# Altium project SW_SWITCHED_LPF_BANK.PrjPcb
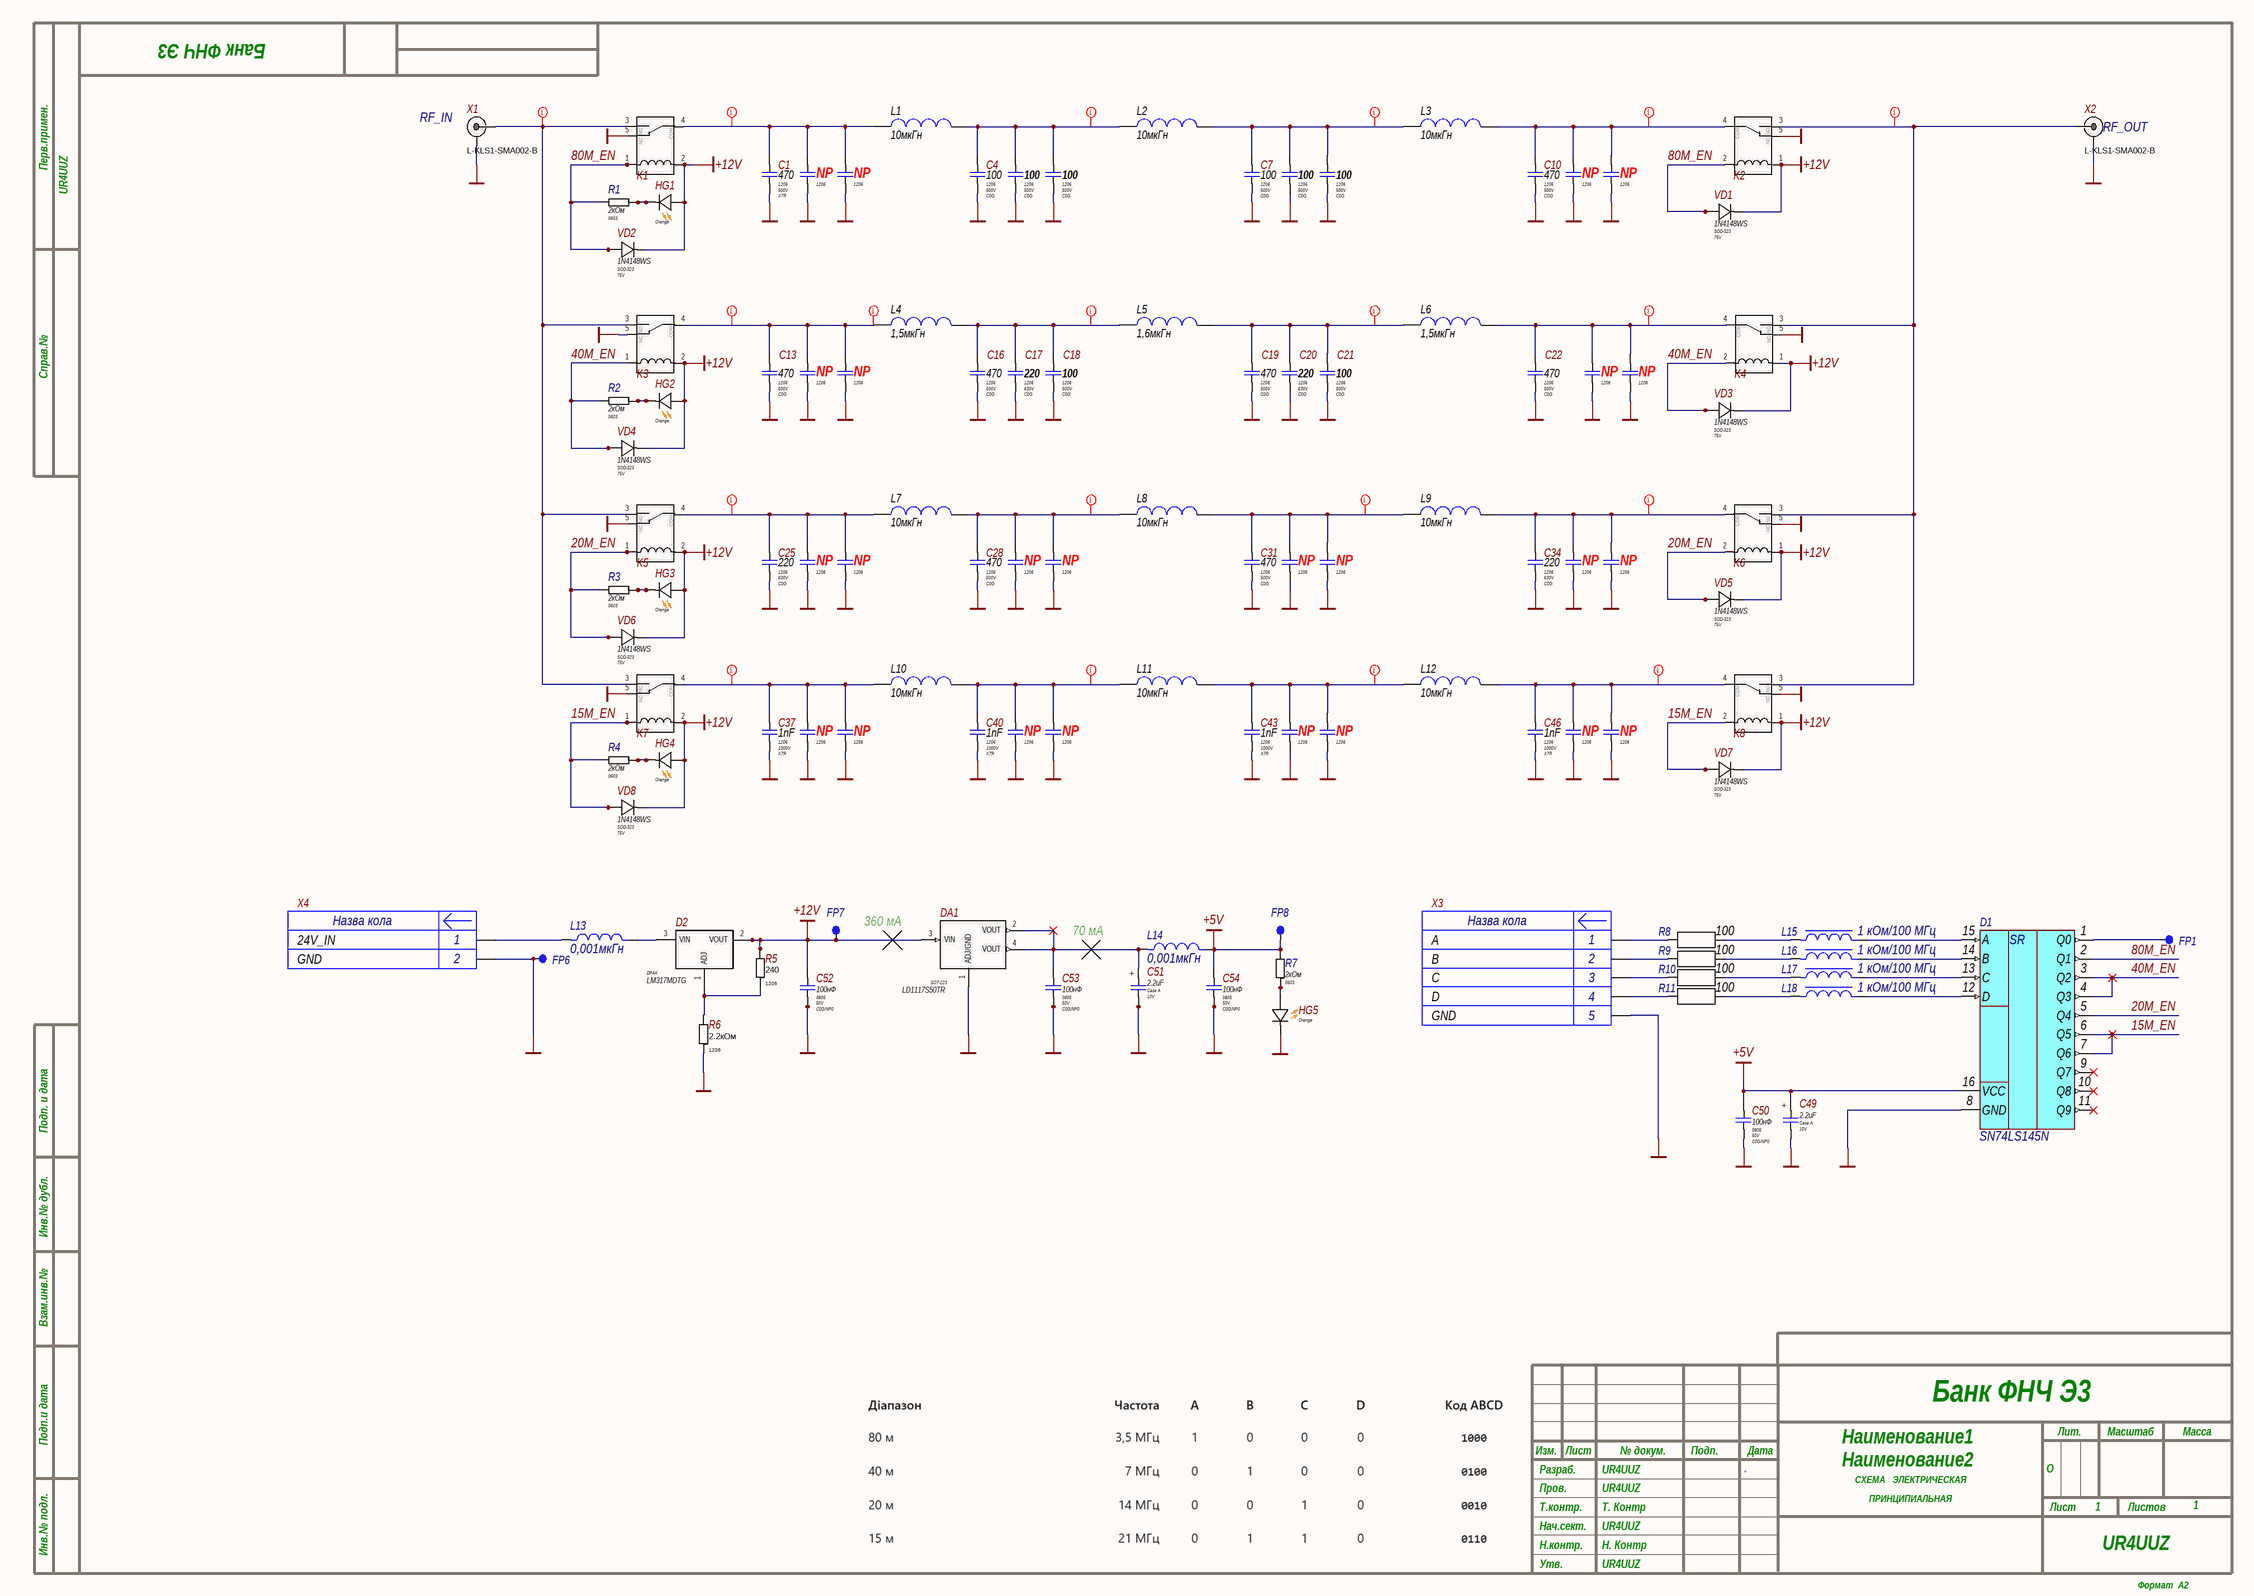
[diagram p0: SW_SWITCHED_LPF_BANK.SchDoc]
__Project_Template_Version: 1.0.2; _Amount_Boards_Per_Stand: 1; _PCB_Order_Accuracy: 0.2mm / 8mil; _PCB_Order_BoardOutlineLayer: Mechanical1 (GM1); _PCB_Order_Cooper: 1oz / 35um; _PCB_Order_ElectricTest: Necessarily for 100% samples; _PCB_Order_Finish: HASL; _PCB_Order_LayersCnt: 2; _PCB_Order_Mask: on both sides; _PCB_Order_MaskColor: Green / Yellow; _PCB_Order_Material: FR-4; _PCB_Order_MinHole: 0.3 mm; _PCB_Order_ProductionTime: 2 weeks; _PCB_Order_Silk: No; _PCB_Order_SilkColor: No; _PCB_Order_Size: 0 x 0 mm; _PCB_Order_Thickness: 1.6 mm; Product_Name: DEV.Tnn.BRD; Project_ID: 621; Project_Version: 1
1 sheet, 115 parts. Net scope: global (net labels, ports and power ports of the same name join across sheets).
Board file: SW_SWITCHED_LPF_BANK.PcbDoc

## Sheet SW_SWITCHED_LPF_BANK.SchDoc: Наименование
size 594 x 420 mm; Product name: DEV.Tnn.BRD; Internal reference: 621; Head: DEV.Tnn.BRD.621.v1; PCB_Designator: DEV.Tnn.BRD.621.v1; Template_version: 1.0.1; ApprovedBy: UR4UUZ; CheckedBy: UR4UUZ; Author: UR4UUZ; CompanyName: UR4UUZ; SheetNumber: 1; SheetTotal: 1; PageSetup: Record=PageOptions|CenterHorizontal=True|CenterVertical=True|PrintScale=0.94|XCorrection=1.00|YCorrection=1.00|PrintKind=1|BorderSize=5000000|LeftOffset=0|BottomOffset=0|Orientation=1|PaperLength=1000|PaperWidth=1000|Scale=100|PaperSource=7|PrintQuality=-4|MediaType=1|DitherType=10|PaperKind=A4|PrintScaleMode=1; DecimalNumber: Банк ФНЧ; HeadOfSector: UR4UUZ; MainDevice: UR4UUZ; Name1: Наименование1; lit_A: О; n_kontr: Н. Контр; t_kontr: Т. Контр; Name2: Наименование2; DocumentName: Sheet1.SCHDOC

### Parts
C1  value 470  Package: 1206  Voltage: 500V  Dielectric Type: X7R  [C_CERAMIC_1206_MED]  (hidden comment: 1nF)
C2  value NP  Package: 1206  [C_CERAMIC_1206_MED]  (hidden comment: 1nF)
C3  value NP  Package: 1206  [C_CERAMIC_1206_MED]  (hidden comment: 1nF)
C4  value 100  Package: 1206  Voltage: 500V  Dielectric Type: C0G  [C_CERAMIC_1206_MED]  (hidden comment: 1nF)
C5  value 100  Package: 1206  Voltage: 500V  Dielectric Type: C0G  [C_CERAMIC_1206_MED]  (hidden comment: 1nF)
C6  value 100  Package: 1206  Voltage: 500V  Dielectric Type: C0G  [C_CERAMIC_1206_MED]  (hidden comment: 1nF)
C7  value 100  Package: 1206  Voltage: 500V  Dielectric Type: C0G  [C_CERAMIC_1206_MED]  (hidden comment: 1nF)
C8  value 100  Package: 1206  Voltage: 500V  Dielectric Type: C0G  [C_CERAMIC_1206_MED]  (hidden comment: 1nF)
C9  value 100  Package: 1206  Voltage: 500V  Dielectric Type: C0G  [C_CERAMIC_1206_MED]  (hidden comment: 1nF)
C10  value 470  Package: 1206  Voltage: 500V  Dielectric Type: COG  [C_CERAMIC_1206_MED]  (hidden comment: 1nF)
C11  value NP  Package: 1206  [C_CERAMIC_1206_MED]  (hidden comment: 1nF)
C12  value NP  Package: 1206  [C_CERAMIC_1206_MED]  (hidden comment: 1nF)
C13  value 470  Package: 1206  Voltage: 500V  Dielectric Type: C0G  [C_CERAMIC_1206_MED]  (hidden comment: 1nF)
C14  value NP  Package: 1206  [C_CERAMIC_1206_MED]  (hidden comment: 1nF)
C15  value NP  Package: 1206  [C_CERAMIC_1206_MED]  (hidden comment: 1nF)
C16  value 470  Package: 1206  Voltage: 500V  Dielectric Type: C0G  [C_CERAMIC_1206_MED]  (hidden comment: 1nF)
C17  value 220  Package: 1206  Voltage: 630V  Dielectric Type: C0G  [C_CERAMIC_1206_MED]  (hidden comment: 1nF)
C18  value 100  Package: 1206  Voltage: 500V  Dielectric Type: C0G  [C_CERAMIC_1206_MED]  (hidden comment: 1nF)
C19  value 470  Package: 1206  Voltage: 500V  Dielectric Type: C0G  [C_CERAMIC_1206_MED]  (hidden comment: 1nF)
C20  value 220  Package: 1206  Voltage: 630V  Dielectric Type: C0G  [C_CERAMIC_1206_MED]  (hidden comment: 1nF)
C21  value 100  Package: 1206  Voltage: 500V  Dielectric Type: C0G  [C_CERAMIC_1206_MED]  (hidden comment: 1nF)
C22  value 470  Package: 1206  Voltage: 500V  Dielectric Type: C0G  [C_CERAMIC_1206_MED]  (hidden comment: 1nF)
C23  value NP  Package: 1206  [C_CERAMIC_1206_MED]  (hidden comment: 1nF)
C24  value NP  Package: 1206  [C_CERAMIC_1206_MED]  (hidden comment: 1nF)
C25  value 220  Package: 1206  Voltage: 630V  Dielectric Type: C0G  [C_CERAMIC_1206_MED]  (hidden comment: 1nF)
C26  value NP  Package: 1206  [C_CERAMIC_1206_MED]  (hidden comment: 1nF)
C27  value NP  Package: 1206  [C_CERAMIC_1206_MED]  (hidden comment: 1nF)
C28  value 470  Package: 1206  Voltage: 500V  Dielectric Type: C0G  [C_CERAMIC_1206_MED]  (hidden comment: 1nF)
C29  value NP  Package: 1206  [C_CERAMIC_1206_MED]  (hidden comment: 1nF)
C30  value NP  Package: 1206  [C_CERAMIC_1206_MED]  (hidden comment: 1nF)
C31  value 470  Package: 1206  Voltage: 500V  Dielectric Type: C0G  [C_CERAMIC_1206_MED]  (hidden comment: 1nF)
C32  value NP  Package: 1206  [C_CERAMIC_1206_MED]  (hidden comment: 1nF)
C33  value NP  Package: 1206  [C_CERAMIC_1206_MED]  (hidden comment: 1nF)
C34  value 220  Package: 1206  Voltage: 630V  Dielectric Type: C0G  [C_CERAMIC_1206_MED]  (hidden comment: 1nF)
C35  value NP  Package: 1206  [C_CERAMIC_1206_MED]  (hidden comment: 1nF)
C36  value NP  Package: 1206  [C_CERAMIC_1206_MED]  (hidden comment: 1nF)
C37  Package: 1206  Voltage: 1000V  Dielectric Type: X7R  [C_CERAMIC_1206_MED]  (hidden comment: 1nF)
C38  value NP  Package: 1206  [C_CERAMIC_1206_MED]  (hidden comment: 1nF)
C39  value NP  Package: 1206  [C_CERAMIC_1206_MED]  (hidden comment: 1nF)
C40  Package: 1206  Voltage: 1000V  Dielectric Type: X7R  [C_CERAMIC_1206_MED]  (hidden comment: 1nF)
C41  value NP  Package: 1206  [C_CERAMIC_1206_MED]  (hidden comment: 1nF)
C42  value NP  Package: 1206  [C_CERAMIC_1206_MED]  (hidden comment: 1nF)
C43  Package: 1206  Voltage: 1000V  Dielectric Type: X7R  [C_CERAMIC_1206_MED]  (hidden comment: 1nF)
C44  value NP  Package: 1206  [C_CERAMIC_1206_MED]  (hidden comment: 1nF)
C45  value NP  Package: 1206  [C_CERAMIC_1206_MED]  (hidden comment: 1nF)
C46  Package: 1206  Voltage: 1000V  Dielectric Type: X7R  [C_CERAMIC_1206_MED]  (hidden comment: 1nF)
C47  value NP  Package: 1206  [C_CERAMIC_1206_MED]  (hidden comment: 1nF)
C48  value NP  Package: 1206  [C_CERAMIC_1206_MED]  (hidden comment: 1nF)
C49  Package: Case A  Voltage: 10V  [C_TANTAL_CASE_A_MED]  (hidden comment: 2.2uF)
C50  value 100нФ  Package: 0805  Voltage: 50V  Dielectric Type: C0G/NP0  [CAP-0805(2012)X85T10]  (hidden comment: 68pF)
C51  Package: Case A  Voltage: 10V  [C_TANTAL_CASE_A_MED]  (hidden comment: 2.2uF)
C52  value 100нФ  Package: 0805  Voltage: 50V  Dielectric Type: C0G/NP0  [CAP-0805(2012)X85T10]  (hidden comment: 68pF)
C53  value 100нФ  Package: 0805  Voltage: 50V  Dielectric Type: C0G/NP0  [CAP-0805(2012)X85T10]  (hidden comment: 68pF)
C54  value 100нФ  Package: 0805  Voltage: 50V  Dielectric Type: C0G/NP0  [CAP-0805(2012)X85T10]  (hidden comment: 68pF)
D1  SN74LS145N  [DIP-16]
D2  LM317MDTG  [DPAK]
DA1  LD1117S50TR  [SOT-223]
FP1  *  [Pad_Disc_1.6x2.0mm_D1.0mm]  (value not drawn)  (no BOM)
FP6  *  [Pad_Disc_1.6x2.0mm_D1.0mm]  (value not drawn)  (no BOM)
FP7  *  [Pad_Disc_1.6x2.0mm_D1.0mm]  (value not drawn)  (no BOM)
FP8  *  [Pad_Disc_1.6x2.0mm_D1.0mm]  (value not drawn)  (no BOM)
HG1  Color: Orange  [LTST-C193KFKT-5A]  (hidden comment: LTST-C193KFKT-5A)
HG2  Color: Orange  [LTST-C193KFKT-5A]  (hidden comment: LTST-C193KFKT-5A)
HG3  Color: Orange  [LTST-C193KFKT-5A]  (hidden comment: LTST-C193KFKT-5A)
HG4  Color: Orange  [LTST-C193KFKT-5A]  (hidden comment: LTST-C193KFKT-5A)
HG5  Color: Orange  [LTST-C193KFKT-5A]  (hidden comment: LTST-C193KFKT-5A)
K1  LEG-12  [LEG-xx]  (value not drawn)
K2  LEG-12  [LEG-xx]  (value not drawn)
K3  LEG-12  [LEG-xx]  (value not drawn)
K4  LEG-12  [LEG-xx]  (value not drawn)
K5  LEG-12  [LEG-xx]  (value not drawn)
K6  LEG-12  [LEG-xx]  (value not drawn)
K7  LEG-12  [LEG-xx]  (value not drawn)
K8  LEG-12  [LEG-xx]  (value not drawn)
L1  value 10мкГн  [IND: R26.9/14.7/11.2 (H)]
L2  value 10мкГн  [IND: R26.9/14.7/11.2 (H)]
L3  value 10мкГн  [IND: R26.9/14.7/11.2 (H)]
L4  value 1,5мкГн  [IND: R26.9/14.7/11.2 (H)]
L5  value 1,6мкГн  [IND: R26.9/14.7/11.2 (H)]
L6  value 1,5мкГн  [IND: R26.9/14.7/11.2 (H)]
L7  value 10мкГн  [IND: R26.9/14.7/11.2 (H)]
L8  value 10мкГн  [IND: R26.9/14.7/11.2 (H)]
L9  value 10мкГн  [IND: R26.9/14.7/11.2 (H)]
L10  value 10мкГн  [IND: R26.9/14.7/11.2 (H)]
L11  value 10мкГн  [IND: R26.9/14.7/11.2 (H)]
L12  value 10мкГн  [IND: R26.9/14.7/11.2 (H)]
L13  0,001мкГн  [INDWW_1206_3.56x2.16x1.52mm_ATC_WL]
L14  0,001мкГн  [INDWW_1206_3.56x2.16x1.52mm_ATC_WL]
L15  1 кОм/100 МГц  [FB_0402_1.0x0.5x0.5mm]
L16  1 кОм/100 МГц  [FB_0402_1.0x0.5x0.5mm]
L17  1 кОм/100 МГц  [FB_0402_1.0x0.5x0.5mm]
L18  1 кОм/100 МГц  [FB_0402_1.0x0.5x0.5mm]
R1  value 2кОм  Package: 0603  [RES0603]  (hidden comment: 2k)
R2  value 2кОм  Package: 0603  [RES0603]  (hidden comment: 2k)
R3  value 2кОм  Package: 0603  [RES0603]  (hidden comment: 2k)
R4  value 2кОм  Package: 0603  [RES0603]  (hidden comment: 2k)
R5  value 240  Package: 1206  [R_ANY_CHIP_1206_MED]  (hidden comment: 499k)
R6  value 2.2кОм  Package: 1206  [R_ANY_CHIP_1206_MED]  (hidden comment: 499k)
R7  value 2кОм  Package: 0603  [RES0603]  (hidden comment: 2k)
R8  100  [R_ANY_CHIP_0402_HI]
R9  100  [R_ANY_CHIP_0402_HI]
R10  100  [R_ANY_CHIP_0402_HI]
R11  100  [R_ANY_CHIP_0402_HI]
VD1  Package: SOD-323  Voltage: 75V  [SOD-323_MED]  (hidden comment: 1N4148WS)
VD2  Package: SOD-323  Voltage: 75V  [SOD-323_MED]  (hidden comment: 1N4148WS)
VD3  Package: SOD-323  Voltage: 75V  [SOD-323_MED]  (hidden comment: 1N4148WS)
VD4  Package: SOD-323  Voltage: 75V  [SOD-323_MED]  (hidden comment: 1N4148WS)
VD5  Package: SOD-323  Voltage: 75V  [SOD-323_MED]  (hidden comment: 1N4148WS)
VD6  Package: SOD-323  Voltage: 75V  [SOD-323_MED]  (hidden comment: 1N4148WS)
VD7  Package: SOD-323  Voltage: 75V  [SOD-323_MED]  (hidden comment: 1N4148WS)
VD8  Package: SOD-323  Voltage: 75V  [SOD-323_MED]  (hidden comment: 1N4148WS)
X1  KLS1-SMA002-B  [KLS1-SMA002]  (value not drawn)
X2  KLS1-SMA002-B  [KLS1-SMA002]  (value not drawn)
X3  WH-05S  [WF-5S]  (value not drawn)
X4  WH-02S  [WF-2S]  (value not drawn)

### Nets
+5V: C49.1 C50.1 C54.1 D1.16(VCC) FP8.1 L14.2 R7.1
+12V: C52.1 D2.2(VOUT) DA1.3(VIN) FP7.1 HG1.AN(Anode) HG2.AN(Anode) HG3.AN(Anode) HG4.AN(Anode) K1.2 K2.1 K3.2 K4.1 K5.2 K6.1 K7.2 K8.1 R5.1 VD1.CA VD2.CA VD3.CA VD4.CA VD5.CA VD6.CA VD7.CA VD8.CA
GND: C1.2 C2.2 C3.2 C4.2 C5.2 C6.2 C7.2 C8.2 C9.2 C10.2 C11.2 C12.2 C13.2 C14.2 C15.2 C16.2 C17.2 C18.2 C19.2 C20.2 C21.2 C22.2 C23.2 C24.2 C25.2 C26.2 C27.2 C28.2 C29.2 C30.2 C31.2 C32.2 C33.2 C34.2 C35.2 C36.2 C37.2 C38.2 C39.2 C40.2 C41.2 C42.2 C43.2 C44.2 C45.2 C46.2 C47.2 C48.2 C49.2 C50.2 C51.2 C52.2 C53.2 C54.2 D1.8(GND) DA1.1(ADJ/GND) FP6.1 HG5.CA(Cathode) K1.5(NC) K2.5(NC) K3.5(NC) K4.5(NC) K5.5(NC) K6.5(NC) K7.5(NC) K8.5(NC) R6.2 X1.2 X2.2 X3.5 X4.2
15M_EN: D1.6(Q5) D1.7(Q6) K7.1 K8.2 R4.1 VD7.AN VD8.AN
20M_EN: D1.5(Q4) K5.1 K6.2 R3.1 VD5.AN VD6.AN
40M_EN: D1.3(Q2) D1.4(Q3) K3.1 K4.2 R2.1 VD3.AN VD4.AN
80M_EN: D1.2(Q1) K1.1 K2.2 R1.1 VD1.AN VD2.AN
NetC1_1: C1.1 C2.1 C3.1 K1.4(COM) L1.2
NetC4_1: C4.1 C5.1 C6.1 L1.1 L2.2
NetC7_1: C7.1 C8.1 C9.1 L2.1 L3.2
NetC10_1: C10.1 C11.1 C12.1 K2.4(COM) L3.1
NetC13_1: C13.1 C14.1 C15.1 K3.4(COM) L4.2
NetC16_1: C16.1 C17.1 C18.1 L4.1 L5.2
NetC19_1: C19.1 C20.1 C21.1 L5.1 L6.2
NetC22_1: C22.1 C23.1 C24.1 K4.4(COM) L6.1
NetC25_1: C25.1 C26.1 C27.1 K5.4(COM) L7.2
NetC28_1: C28.1 C29.1 C30.1 L7.1 L8.2
NetC31_1: C31.1 C32.1 C33.1 L8.1 L9.2
NetC34_1: C34.1 C35.1 C36.1 K6.4(COM) L9.1
NetC37_1: C37.1 C38.1 C39.1 K7.4(COM) L10.2
NetC40_1: C40.1 C41.1 C42.1 L10.1 L11.2
NetC43_1: C43.1 C44.1 C45.1 L11.1 L12.2
NetC46_1: C46.1 C47.1 C48.1 K8.4(COM) L12.1
NetC51_1: C51.1 C53.1 DA1.2(VOUT) DA1.4(VOUT) L14.1
NetD1_1: D1.1(Q0) FP1.1
NetD1_12: D1.12(D) L18.2
NetD1_13: D1.13(C) L17.2
NetD1_14: D1.14(B) L16.2
NetD1_15: D1.15(A) L15.2
NetD2_1: D2.1(ADJ) R5.2 R6.1
NetD2_3: D2.3(VIN) L13.2
NetHG1_CA: HG1.CA(Cathode) R1.2
NetHG2_CA: HG2.CA(Cathode) R2.2
NetHG3_CA: HG3.CA(Cathode) R3.2
NetHG4_CA: HG4.CA(Cathode) R4.2
NetHG5_AN: HG5.AN(Anode) R7.2
NetK1_3: K1.3(NO) K3.3(NO) K5.3(NO) K7.3(NO) X1.1
NetK2_3: K2.3(NO) K4.3(NO) K6.3(NO) K8.3(NO) X2.1
NetL13_1: L13.1 X4.1
NetL15_1: L15.1 R8.2
NetL16_1: L16.1 R9.2
NetL17_1: L17.1 R10.2
NetL18_1: L18.1 R11.2
NetR8_1: R8.1 X3.1
NetR9_1: R9.1 X3.2
NetR10_1: R10.1 X3.3
NetR11_1: R11.1 X3.4

Not connected (* = marked no-connect by the designer): D1 9(Q7)* 10(Q8)* 11(Q9)*

### Layout directives
net class CPW: NetC1_1, NetC4_1, NetC7_1, NetC10_1, NetC13_1, NetC16_1, NetC19_1, NetC22_1, NetC25_1, NetC28_1, NetC31_1, NetC34_1, NetC37_1, NetC40_1, NetC43_1, NetC46_1, NetK1_3, NetK2_3

### Notes on the sheet
- (near X1) RF_IN
- (near X2) RF_OUT
- 360 мА
- 70 мА
- 24V_IN
- GND
- A
- B
- C
- D
- Перв.примен.
- Справ.№
- Подп. и дата
- Инв.№ дубл.
- Взам.инв.№
- Подп.и дата
- Разраб.
- Изм.
- Лист
- № докум.
- Подп.
- Дата
- Лит.
- Масштаб
- Масса
- Т.контр.
- Пров.
- СХЕМА   ЭЛЕКТРИЧЕСКАЯ
- ПРИНЦИПИАЛЬНАЯ
- Листов
- Инв.№ подл.
- Утв.
- Н.контр.
- Нач.сект.
- Формат  A2
- (in symbol CI3102P1V00) Назва кола
- (in symbol CI3105P1V00) Назва кола
- (in symbol SN74LS145N) SR
- (in symbol TAJA225K010SNJ) +

### Library data of the parts
C1 C10 C13 C16 C19 C22 C28 C31 = 1206B102K102CG: 1nF 1000V X7R ±10% 1206 Ceramic Capacitor RoHS; Part Number: 1206N471J501CT; Manufacturer: Walsin; Standard Lead Time: 31 Weeks; Component Status: Released; Replacement: NONE; Component Type: SMD; Temperature Range: -55°C ~ 125°C; Tolerance: ±10%; ComponentLink1URL: https://eu.mouser.com/datasheet/2/210/Middle_and_High_Voltage_DS-1535659.pdf; Supplier 1: Mouser; Supplier Part Number 1: 791-1206B102K102CT; Price: 0; ComponentLink1Description: Datasheet
  C1 C10 C28 C31: Part Type: Ceramic / X7R / 1206
  C13 C16 C19 C22: Part Type: Ceramic / C0G / 1206
C2 C3 C11 C12 C14 C15 C23 C24 C26 C27 C29 C30 C32 C33 C35-C48 = 1206B102K102CG: 1nF 1000V X7R ±10% 1206 Ceramic Capacitor RoHS; Manufacturer: Walsin; Standard Lead Time: 31 Weeks; Component Status: Released; Replacement: NONE; Part Number: 1206B102K102CG; Part Type: Ceramic / X7R / 1206; Component Type: SMD; Temperature Range: -55°C ~ 125°C; Tolerance: ±10%; ComponentLink1URL: https://eu.mouser.com/datasheet/2/210/Middle_and_High_Voltage_DS-1535659.pdf; Supplier 1: Mouser; Supplier Part Number 1: 791-1206B102K102CT; Price: 0; ComponentLink1Description: Datasheet
  C2 C3 C11 C12 C14 C15 C23 C24 C26 C27 C29 C30 C32 C33 C35 C36 C38 C39 C41 C42 C44 C45 C47 C48: Voltage: 1000V; Dielectric Type: X7R
  C37 C40 C43 C46: Value: 1nF
C4-C9 C18 C21 = 1206B102K102CG: 1nF 1000V X7R ±10% 1206 Ceramic Capacitor RoHS; Part Number: 12067A101JAT2A; Manufacturer: AVX; Standard Lead Time: 31 Weeks; Component Status: Released; Replacement: NONE; Component Type: SMD; Temperature Range: -55°C ~ 125°C; Tolerance: ±10%; ComponentLink1URL: https://eu.mouser.com/datasheet/2/210/Middle_and_High_Voltage_DS-1535659.pdf; Supplier 1: Mouser; Supplier Part Number 1: 791-1206B102K102CT; Price: 0; ComponentLink1Description: Datasheet
  C4-C9: Part Type: Ceramic / X7R / 1206
  C18 C21: Part Type: Ceramic / C0G / 1206
C17 C20 = 1206B102K102CG: 1nF 1000V X7R ±10% 1206 Ceramic Capacitor RoHS; Part Number: GRM31A5C2J221JW01D; Manufacturer: Murata; Standard Lead Time: 31 Weeks; Component Status: Released; Replacement: NONE; Part Type: Ceramic / C0G / 1206; Component Type: SMD; Temperature Range: -55°C ~ 125°C; Tolerance: ±10%; ComponentLink1URL: https://eu.mouser.com/datasheet/2/210/Middle_and_High_Voltage_DS-1535659.pdf; Supplier 1: Mouser; Supplier Part Number 1: 791-1206B102K102CT; Price: 0; ComponentLink1Description: Datasheet
C25 C34 = 1206B102K102CG: 1nF 1000V X7R ±10% 1206 Ceramic Capacitor RoHS; Part Number: GRM31A5C2J221JW01D; Manufacturer: MURATA; Standard Lead Time: 31 Weeks; Component Status: Released; Replacement: NONE; Part Type: Ceramic / X7R / 1206; Component Type: SMD; Temperature Range: -55°C ~ 125°C; Tolerance: ±10%; ComponentLink1URL: https://eu.mouser.com/datasheet/2/210/Middle_and_High_Voltage_DS-1535659.pdf; Supplier 1: Mouser; Supplier Part Number 1: 791-1206B102K102CT; Price: 0; ComponentLink1Description: Datasheet
C49 C51 = TAJA225K010SNJ: 2.2uF 10V ±10% Case A Tantalum Capacitors, ESR 7Ohm; Manufacturer: AVX; Standard Lead Time: 11 Weeks; Component Status: Released; Dielectric Type: NONE; Part Number: TAJA225K010SNJ; Part Type: Tantalum; Component Type: SMD; Temperature Range: -55°C ~ 125°C; Tolerance: ±10%; ComponentLink1URL: https://eu.mouser.com/datasheet/2/40/TAJ-3165264.pdf; Supplier 1: Mouser; Supplier Part Number 1: 581-TAJA225K010SNJ; Replacement: NONE; Price: 0.118; ComponentLink1Description: Datasheet; Value: 2.2uF
C50 C52-C54 = 08055A680JAT2A: 68pF 50V C0G, NP0 ±5% 0805 Ceramic Capacitor RoHS; Manufacturer: AVX; Standard Lead Time: 12 Weeks; Component Status: Released; Replacement: NONE; Part Number: 08055A680JAT2A; Part Type: Ceramic / C0G(NP0) / 0805; Component Type: SMD; Temperature Range: -55°C ~ 125°C; Tolerance: ±5%; ComponentLink1URL: http://catalogs.avx.com/SurfaceMount.pdf; Supplier 1: Digi-Key; Supplier Part Number 1: 478-1314-2-ND; Price: NONE; ComponentLink1Description: Datasheet
D1 = SN74LS145N: IC DECODER 1 X 4:10 16-PDIP; Manufacturer: Texas Instruments; Type: Мікросхема; Name: SN74LS145N [Texas Instruments]; Package: 16-DIP; Mount: SMT; Min Operating Temperature: -40°C; Max Operating Temperature: +125°C; ComponentLink1Description1: *; ComponentLink1Description: Datasheet Link; ComponentLink1Description: New link; ComponentLink1URL: https://www.ti.com/lit/ds/symlink/sn74145.pdf?HQS=dis-dk-null-digikeymode-dsf-pf-null-wwe&ts=1783117745260&ref_url=https%253A%252F%252Fr150.goodao.net%252Fproduct%252Fproduct%252Fdownload%253Furl%253DUGNIczE4OHMvT1JqdlZxajlkZVNNOWFaeXhtd3pUcE5LdENtL2VVTzFqR0lQaThUMmRtclkvUzh0cEVMcDNKUnlTUkZVNzdyTFpOTjZMY3ZmR0k5aFpWODJjczRNQStKWnYzVjZmYk5SbUpWK2RhZ3VjVWF5MHNNRnFsOFRFbS9PT043ZUJURVZDRE1ocGJwc1ZMUTUyelh4SXY2Z1RkR0NFamlLWkhrbThvPQ%253D%253D; Number of Pins: 16; Component Function: Decoder 1 x 4:10 16-PDIP; Part Number: SN74LS145N
D2 = LM317MDTG: 4.25V to 40V Input Linear Voltage Regulator, 1 Output 500mA, Adjustable, TO-252-3 (DPAK); Manufacturer: Onsemi; Standard Lead Time: 61 Weeks; Component Status: Released; Replacement: NONE; Package: DPAK; Part Number: LM317MDTG; Lifecycle: Packaging Not for Production; Part Type: Power / Linear Regulator; Component Type: SMD; Temperature Range: 0°C ~ 125°C; ComponentLink1URL: https://eu.mouser.com/datasheet/2/308/LM317M_D-1810713.pdf; Supplier 1: Mouser; Supplier Part Number 1: 863-LM317MDTG; Price: 0.352; ComponentLink1Description: Datasheet
DA1 = LD1117S50TR: Adjustable and fixed low drop positive voltage regulator, 5V 800mA, 1.25V to 15V Vin; Manufacturer: STMicroelectronics; Standard Lead Time: 14 Weeks; Component Status: Released; Replacement: NONE; Part Type: Power / Linear Regulator; Component Type: SMD; Temperature Range: 0°C ~ 125°C; ComponentLink1URL: https://www.st.com/content/ccc/resource/technical/document/datasheet/99/3b/7d/91/91/51/4b/be/CD00000544.pdf/files/CD00000544.pdf/jcr:content/translations/en.CD00000544.pdf; Supplier 1: Digi-Key; Supplier Part Number 1: 497-6447-2-ND; Price: 0.66; ComponentLink1Description: Datasheet; Package: SOT-223; Part Number: LD1117S50TR
FP1 FP6-FP8 = IN-OUT DIP_1.6x2_d1.0: In-Out Pad 2x1 mm; Component Function: *; Value: *
HG1-HG5 = LTST-C193KFKT-5A: Indication LED, Orange 605nm, Clear, SMD 0603, Vf 1.7V - 2.3V, 11.2 ~ 45mcd @ 5 mA, 130°; Manufacturer: Lite-On Optoelectronics; Component Status: Released; Replacement: NONE; GUID_1C: f1c02737-053e-11ea-ab58-0050569f2651; Part Number: LTST-C193KFKT-5A; Part Type: LED / 0603; Component Type: SMD; Package: 0603; Wavelength: 605nm; Temperature Range: -30°C ~ 85°C; Supplier 1: Digi-Key; Supplier Part Number 1: 160-1829-2-ND; Price: 0.02; ComponentLink1Description: Datasheet
K1-K8 = LEG-12: General Purpose Relay, 1 Form C (1PDT), 12VDC 400Ohm Coil, 120VAC/24VDC @ 10A, 240VAC Max; Manufacturer: Recoy/Rayex Electronics; Component Status: Released; Replacement: NONE; Part Type: Relay; Component Type: PTH; Temperature Range: -25°C ~ 80°C; Price: 0.54089086; ComponentLink1Description: Datasheet
L1-L3 L7-L12 = Inductor_R26.9/14.7/11.2: Manufacturer: Magnetics; PartNumber: 0077930A7; ValueManufacturerPartNumber: Fixed inductor, 10мкГн, ±20%, R26.9/14.7/11.2, Kool Mu, µ=125, 157 нГн/витков2; TypeInductor: Fixed inductor; TypeMatiriel: Kool Mu; AL: 157 нГн/витков2; MaterialPermeability: µ=125; Tolerance: ±20%; Package: R26.9/14.7/11.2; HelpURL: http://ferrite.ru/warehouse/r-26-914-711-2-77930-a7.html
L4 L6 = Inductor_R26.9/14.7/11.2: Manufacturer: Magnetics; PartNumber: 0077930A7; ValueManufacturerPartNumber: Fixed inductor, 1,5мкГн, ±20%, R26.9/14.7/11.2, Kool Mu, µ=125, 157 нГн/витков2; TypeInductor: Fixed inductor; TypeMatiriel: Kool Mu; AL: 157 нГн/витков2; MaterialPermeability: µ=125; Tolerance: ±20%; Package: R26.9/14.7/11.2; HelpURL: http://ferrite.ru/warehouse/r-26-914-711-2-77930-a7.html
L5 = Inductor_R26.9/14.7/11.2: Manufacturer: Magnetics; PartNumber: 0077930A7; ValueManufacturerPartNumber: Fixed inductor, 1,6мкГн, ±20%, R26.9/14.7/11.2, Kool Mu, µ=125, 157 нГн/витков2; TypeInductor: Fixed inductor; TypeMatiriel: Kool Mu; AL: 157 нГн/витков2; MaterialPermeability: µ=125; Tolerance: ±20%; Package: R26.9/14.7/11.2; HelpURL: http://ferrite.ru/warehouse/r-26-914-711-2-77930-a7.html
L13 L14 = INDWW_SMD_1206: nH Unshielded Wirewound Inductor  A mOhm 1206; Manufacturer: Murata; Current Rating (Max): 4 A; Type: Котушка індуктивності; Name: 0,001мкГн ±*% 4 A 1206 * [Murata]; DC Resistance (DCR) (Max): 8 мОм; Q @ Frequency: 30 @ 100 МГц; SRF: 100 МГц; Tolerance: ±*%; Part Number: *; Package: 1206; Value: 0,001мкГн; Mount: SMT; Min Operating Temperature: -55°C; Max Operating Temperature: +125°C; ComponentLink1Description1: *; ComponentLink1Description: Datasheet Link; ComponentLink1Description: New link; Number of Pins: 2; Component Function: *
L15-L18 = FERRITE_BEAD_SMD_0402: Ferrite Bead SMD 0402; Manufacturer: Murata; Part Number: BLM15AX102SN1D; Current Rating (Max): 4 A; Type: Фільтр феритовий; Name: Impedance / Frequency Current Rating (Max) 0402 BLM15AX102SN1D [Murata]; DC Resistance (DCR) (Max): 8 мОм; Impedance / Frequency: 33 Ом/100 МГц; Package: 0402; Value: 1 кОм/100 МГц; Mount: SMT; Min Operating Temperature: -55°C; Max Operating Temperature: +125°C; ComponentLink1Description1: *; ComponentLink1Description: Datasheet Link; ComponentLink1Description: New link; Number of Pins: 2; Component Function: *
R1-R4 R7 = ERJ-3RQFR47V: RES 2K OHM 1% 1/10W 0603; Manufacturer: Panasonic Electronic Components; Voltage: 50V; Part Number: ERJ-3RQFR47V; Component Type: SMD; Tolerance: 1%
R5 R6 = CHV1206-FX-4993ELF: 499 kOhms ±1%, 1/4W 1206 Thick Film Resistor; Manufacturer: Bourns; Ajax_1C_PN: NONE; Ajax_1С_Status: RND Only; Power Rating: 0.25W; Voltage: 800V; Component Status: Released; Temperature Stability: ±100ppm/°C; Tolerance: ±1%; Part Number: CHV1206-FX-4993ELF; Component Type: SMD; Part Type: Thick Film; Temperature Range: -55°C ~ 155°C; ComponentLink1URL: https://eu.mouser.com/datasheet/2/54/CHV-777595.pdf; Supplier 1: Mouser; Supplier Part Number 1: 652-CHV1206FX4993ELF; Replacement: NONE; Price: NONE; ComponentLink1Description: Datasheet
R8-R11 = RES_0402: RES 0.47 OHM 1% 1/16W 0402; Manufacturer: Panasonic Electronic Components; Part Number: ERJ-3RQFR47V; Voltage: 50V; Component Type: SMD; Package: 0402; Tolerance: 1%; Value: 100
VD1-VD8 = 1N4148WS-E3-08: Diode Standard 75V 150mA, SOD-323; Manufacturer: Vishay Semiconductor; Marking: A2; Component Status: Released; Standard Lead Time: 12 Weeks; Vf: 1.2V @ 100mA; Part Type: Fast Switching; Component Type: SMD; Current: 150mA; Temperature Range: -55°C ~ 150°C; Supplier 1: Digi-Key; Supplier Part Number 1: 1N4148WS-E3-08TR-ND; Replacement: 1N4148WS; Price: 0.03132463; ComponentLink1Description: Datasheet; Part Number: 1N4148WS
X1 X2 = L-KLS1-SMA002-B: 50Ohm SMA Connector, Right Angle, Female, 5.08mm; Manufacturer: KLS Electronic; Replacement: NONE; Part Number: L-KLS1-SMA002-B; Part Type: RF Connector; Component Type: PTH; Temperature Range: -55°C ~ 155°C; Price: 0.56474318; ComponentLink1Description: Datasheet
X3 = CI3105P1V00: WH Series 2.54mm Wire to Board Straight DIP Type Headers, 5 Pin; Manufacturer: CviLux; Replacement: NONE; Part Type: Wire-to-Board / Header; Component Type: PTH; Temperature Range: -25℃ ~ 85℃; Price: 0.04446498; ComponentLink1Description: Datasheet
X4 = CI3102P1V00: WH Series 2.54mm Wire to Board Straight DIP Type Headers, 2 Pin; Manufacturer: CviLux; Replacement: NONE; Part Type: Wire-to-Board / Header; Component Type: PTH; Temperature Range: -25℃ ~ 85℃; Price: 0.02434867; ComponentLink1Description: Datasheet